# Altium schematic sheet [01] - POWER.SchDoc
size A3
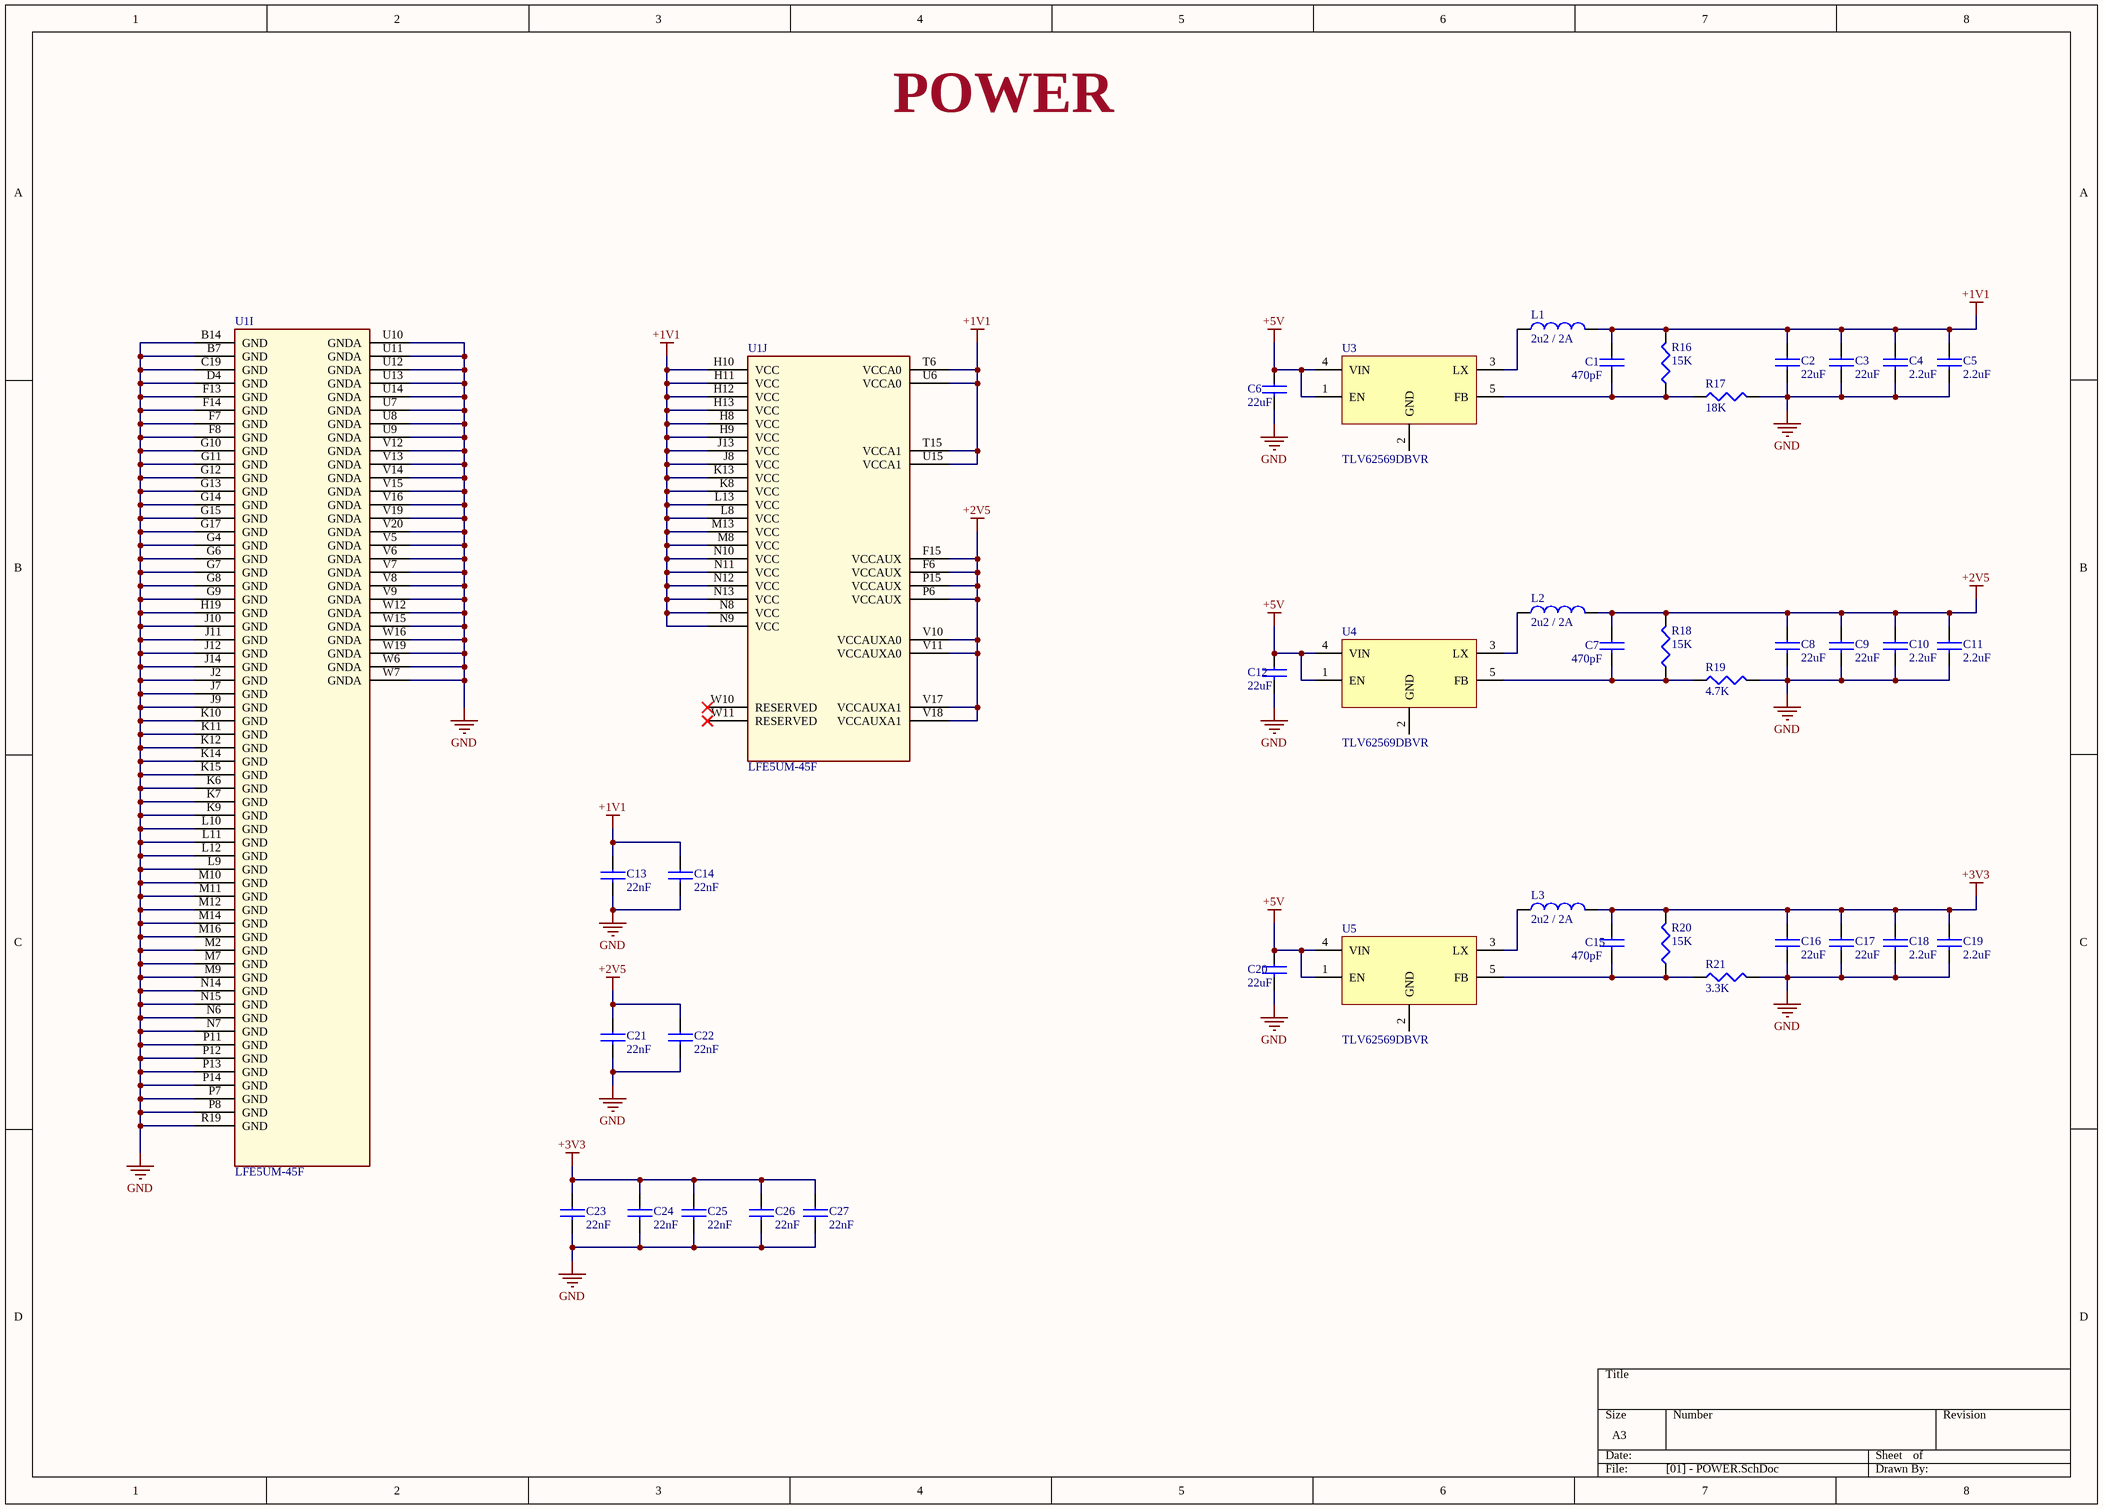
[diagram p0: [01] - POWER.SchDoc]

## Parts
C1  470pF  [C0603]
C2  22uF  [C0805]
C3  22uF  [C0805]
C4  2.2uF  [C0805]
C5  2.2uF  [C0805]
C6  22uF  [C0805]
C7  470pF  [C0603]
C8  22uF  [C0805]
C9  22uF  [C0805]
C10  2.2uF  [C0805]
C11  2.2uF  [C0805]
C12  22uF  [C0805]
C13  22nF  [C0603]
C14  22nF  [C0603]
C15  470pF  [C0603]
C16  22uF  [C0805]
C17  22uF  [C0805]
C18  2.2uF  [C0805]
C19  2.2uF  [C0805]
C20  22uF  [C0805]
C21  22nF  [C0603]
C22  22nF  [C0603]
C23  22nF  [C0603]
C24  22nF  [C0603]
C25  22nF  [C0603]
C26  22nF  [C0603]
C27  22nF  [C0603]
L1  2u2 / 2A  [C1210_IND]
L2  2u2 / 2A  [C1210_IND]
L3  2u2 / 2A  [C1210_IND]
R16  15K  [R0603]
R17  18K  [R0603]
R18  15K  [R0603]
R19  4.7K  [R0603]
R20  15K  [R0603]
R21  3.3K  [R0603]
U1  LFE5UM-45F  [LFE5BG381]  (parts I,J of 11)
U3  TLV62569DBVR  [SOT95P370X145-5N]
U4  TLV62569DBVR  [SOT95P370X145-5N]
U5  TLV62569DBVR  [SOT95P370X145-5N]

## Nets
+1V1: C1.1 C2.1 C3.1 C4.1 C5.1 C13.1 C14.1 L1.2 R16.2 U1.H8(VCC) U1.H9(VCC) U1.H10(VCC) U1.H11(VCC) U1.H12(VCC) U1.H13(VCC) U1.J8(VCC) U1.J13(VCC) U1.K8(VCC) U1.K13(VCC) U1.L8(VCC) U1.L13(VCC) U1.M8(VCC) U1.M13(VCC) U1.N8(VCC) U1.N9(VCC) U1.N10(VCC) U1.N11(VCC) U1.N12(VCC) U1.N13(VCC) U1.T6(VCCA0) U1.T15(VCCA1) U1.U6(VCCA0) U1.U15(VCCA1)
+2V5: C7.1 C8.1 C9.1 C10.1 C11.1 C21.1 C22.1 L2.2 R18.2 U1.F6(VCCAUX) U1.F15(VCCAUX) U1.P6(VCCAUX) U1.P15(VCCAUX) U1.V10(VCCAUXA0) U1.V11(VCCAUXA0) U1.V17(VCCAUXA1) U1.V18(VCCAUXA1)
+3V3: C15.1 C16.1 C17.1 C18.1 C19.1 C23.1 C24.1 C25.1 C26.1 C27.1 L3.2 R20.2
+5V: C6.1 C12.1 C20.1 U3.1(EN) U3.4(VIN) U4.1(EN) U4.4(VIN) U5.1(EN) U5.4(VIN)
GND: C2.2 C3.2 C4.2 C5.2 C6.2 C8.2 C9.2 C10.2 C11.2 C12.2 C13.2 C14.2 C16.2 C17.2 C18.2 C19.2 C20.2 C21.2 C22.2 C23.2 C24.2 C25.2 C26.2 C27.2 R17.2 R19.2 R21.2 U1.B7(GND) U1.B14(GND) U1.C19(GND) U1.D4(GND) U1.F7(GND) U1.F8(GND) U1.F13(GND) U1.F14(GND) U1.G4(GND) U1.G6(GND) U1.G7(GND) U1.G8(GND) U1.G9(GND) U1.G10(GND) U1.G11(GND) U1.G12(GND) U1.G13(GND) U1.G14(GND) U1.G15(GND) U1.G17(GND) U1.H19(GND) U1.J2(GND) U1.J7(GND) U1.J9(GND) U1.J10(GND) U1.J11(GND) U1.J12(GND) U1.J14(GND) U1.K6(GND) U1.K7(GND) U1.K9(GND) U1.K10(GND) U1.K11(GND) U1.K12(GND) U1.K14(GND) U1.K15(GND) U1.L9(GND) U1.L10(GND) U1.L11(GND) U1.L12(GND) U1.M2(GND) U1.M7(GND) U1.M9(GND) U1.M10(GND) U1.M11(GND) U1.M12(GND) U1.M14(GND) U1.M16(GND) U1.N6(GND) U1.N7(GND) U1.N14(GND) U1.N15(GND) U1.P7(GND) U1.P8(GND) U1.P11(GND) U1.P12(GND) U1.P13(GND) U1.P14(GND) U1.R19(GND) U1.U7(GNDA) U1.U8(GNDA) U1.U9(GNDA) U1.U10(GNDA) U1.U11(GNDA) U1.U12(GNDA) U1.U13(GNDA) U1.U14(GNDA) U1.V5(GNDA) U1.V6(GNDA) U1.V7(GNDA) U1.V8(GNDA) U1.V9(GNDA) U1.V12(GNDA) U1.V13(GNDA) U1.V14(GNDA) U1.V15(GNDA) U1.V16(GNDA) U1.V19(GNDA) U1.V20(GNDA) U1.W6(GNDA) U1.W7(GNDA) U1.W12(GNDA) U1.W15(GNDA) U1.W16(GNDA) U1.W19(GNDA)
NetC1_2: C1.2 R16.1 R17.1 U3.5(FB)
NetC7_2: C7.2 R18.1 R19.1 U4.5(FB)
NetC15_2: C15.2 R20.1 R21.1 U5.5(FB)
NetL1_1: L1.1 U3.3(LX)
NetL2_1: L2.1 U4.3(LX)
NetL3_1: L3.1 U5.3(LX)

Not connected (* = marked no-connect by the designer): U1 W10(RESERVED)* W11(RESERVED)*; U3 2(GND); U4 2(GND); U5 2(GND)

## Notes on the sheet
- POWER

## Library data of the parts
C1 C7 C15 = C0603C471K3RACTU: KEMET - C0603C471K3RACTU - SMD Multilayer Ceramic Capacitor, 470 pF, 25 V, 0603 [1608 Metric], ± 10%, X7R, C Series KEMET; Voltage Rating: 25V; Supplier 1: Digi-Key; Manufacturer: KEMET; Manufacturer Part Number: C0603C471K3RACTU; Stock 1: 28906; Pricing 1: 1=0.1, 10=0.067, 100=0.0298, 500=0.02126, 1000=0.0167 (USD); Mount: Surface Mount; Case/Package: 0603; Case Code (Metric): 1608; Case Code (Imperial): 0603; Dielectric Material: Ceramic; Min Operating Temperature: -55°C; Max Operating Temperature: 125°C; Package Quantity: 4000; Capacitance: 470pF; Tolerance: 10%; Packaging: Tape and Reel; Voltage Rating (DC): 25V; Dielectric: X7R; Termination: SMD/SMT; Length: 1.6mm; Height: 0.8mm; Width: 0.031inch; Thickness: 0.034inch; Lead Pitch: 0.7mm; Depth: 0.8mm; Radiation Hardening: No; REACH SVHC: No SVHC; ComponentLink1URL: http://www.farnell.com/datasheets/2064971.pdf?src-supplier=Element14; ComponentLink1Description: http://www.farnell.com/datasheets/2064971.pdf?src-supplier=Element14; ComponentLink2URL: http://www.farnell.com/datasheets/2746078.pdf?src-supplier=Farnell; ComponentLink2Description: http://www.farnell.com/datasheets/2746078.pdf?src-supplier=Farnell; ComponentLink3URL: https://api.kemet.com/component-edge/download/datasheet/C0603C471K3RACTU.pdf?src-supplier=Digi-Key; ComponentLink3Description: https://api.kemet.com/component-edge/download/datasheet/C0603C471K3RACTU.pdf?src-supplier=Digi-Key; ComponentLink4URL: http://components.arrow.com/part/dataview/2089229S9467247N7429?src-supplier=Arrow; ComponentLink4Description: http://components.arrow.com/part/dataview/2089229S9467247N7429?src-supplier=Arrow; ComponentLink5URL: http://www.mouser.com/ds/2/212/KEM_C1002_X7R_SMD-1102033.pdf?src-supplier=Mouser; ComponentLink5Description: http://www.mouser.com/ds/2/212/KEM_C1002_X7R_SMD-1102033.pdf?src-supplier=Mouser; ComponentLink6URL: http://www.farnell.com/datasheets/2746078.pdf?src-supplier=Newark; ComponentLink6Description: http://www.farnell.com/datasheets/2746078.pdf?src-supplier=Newark; ComponentLink7URL: http://components.arrow.com/part/dataview/0323_00323242?src-supplier=Arrow+Europe; ComponentLink7Description: http://components.arrow.com/part/dataview/0323_00323242?src-supplier=Arrow+Europe; Supplier Part Number 1: 399-9086-6-ND
C2 C3 C6 C8 C9 C12 C16 C17 C20 = CL21A226MQCLRNC: CAP CER 22UF 6.3V X5R 0805; Manufacturer: Samsung; Tolerance: 20%; Supplier 1: Digi-Key; Manufacturer Part Number: CL21A226MQCLRNC; Stock 1: 271195; Pricing 1: 1=0.36, 10=0.247, 100=0.1484, 500=0.11132, 1000=0.09401 (USD); Mount: Surface Mount; Case/Package: 0805; Case Code (Metric): 2012; Case Code (Imperial): 0805; Min Operating Temperature: -55°C; Max Operating Temperature: 85°C; Capacitance: 22uF; Dielectric: X5R; Package Quantity: 1; Packaging: Tape and Reel; Voltage Rating: 6.3V; Length: 2mm; Height: 0.85mm; Depth: 1.25mm; Width: 0.049inch; Thickness: 0.037inch; Radiation Hardening: No; Lead Free: Lead Free; ComponentLink1URL: http://www.samsungsem.com/kr/support/product-search/mlcc/CL21A226MQCLRNC.jsp?src-supplier=Digi-Key; ComponentLink1Description: http://www.samsungsem.com/kr/support/product-search/mlcc/CL21A226MQCLRNC.jsp?src-supplier=Digi-Key; Supplier Part Number 1: 1276-2413-6-ND
C4 C5 C10 C11 C18 C19 = CL21A225KAFNNNG: Ceramic capacitor SMD 0805 2.2 µF 25 V 10 %; Manufacturer: Samsung; Voltage Rating: 25V; Tolerance: 10%; Supplier 1: Digi-Key; Manufacturer Part Number: CL21A225KAFNNNG; Stock 1: 303381; Pricing 1: 1=0.15, 10=0.11, 100=0.0517, 500=0.03626, 1000=0.03002 (USD); Mount: Surface Mount; Case/Package: 0805; Case Code (Metric): 2012; Case Code (Imperial): 0805; Material: Ceramic; Min Operating Temperature: -55°C; Max Operating Temperature: 85°C; Package Quantity: 3000; Packaging: Tape and Reel; Capacitance: 2.2uF; Length: 0.079inch; Width: 0.049inch; Thickness: 0.053inch; ComponentLink1URL: http://www.samsungsem.com/global/support/library/product-catalog/__icsFiles/afieldfile/2014/11/13/MLCC.pdf?src-supplier=Digi-Key; ComponentLink1Description: http://www.samsungsem.com/global/support/library/product-catalog/__icsFiles/afieldfile/2014/11/13/MLCC.pdf?src-supplier=Digi-Key; ComponentLink2URL: https://produktinfo.conrad.com/datenblaetter/450000-474999/455579-da-01-en-VS_KONDENSATOR_0805.pdf?src-supplier=Conrad; ComponentLink2Description: https://produktinfo.conrad.com/datenblaetter/450000-474999/455579-da-01-en-VS_KONDENSATOR_0805.pdf?src-supplier=Conrad; Supplier Part Number 1: 1276-6458-6-ND
C13 C14 C21-C27 = CX0603MRX7R8BB223: Feed Through Capacitors 22nF X7R 20% 25V; Manufacturer: Yageo; Supplier 1: Digi-Key; Manufacturer Part Number: CX0603MRX7R8BB223; Stock 1: 11069; Pricing 1: 1=0.92, 10=0.676, 100=0.4636, 500=0.36702, 1000=0.30907 (USD); Mount: Surface Mount; Case/Package: 0603; Number of Pins: 2; Case Code (Metric): 1608; Case Code (Imperial): 0603; Min Operating Temperature: -55°C; Max Operating Temperature: 125°C; Capacitance: 22nF; Tolerance: 20%; Voltage Rating: 25V; Package Quantity: 1; Packaging: Tape and Reel; Voltage Rating (DC): 25V; Dielectric: X7R; Termination: SMD/SMT; Length: 0.063inch; Height: 0.65mm; Width: 0.034inch; Thickness: 0.03inch; REACH SVHC: No SVHC; Lead Free: Lead Free; ComponentLink1URL: http://www.yageo.com/NewPortal/_en/search/productDocs.jsp?YageoPartNumber=CX0603MRX7R8BB223&src-supplier=Digi-Key; ComponentLink1Description: http://www.yageo.com/NewPortal/_en/search/productDocs.jsp?YageoPartNumber=CX0603MRX7R8BB223&src-supplier=Digi-Key; Supplier Part Number 1: 311-1234-6-ND
L1-L3 = L1210R2R2MDWIT: FIXED IND 2.2UH 2A 80 MOHM SMD; Manufacturer: KEMET; Core Material: Ferrite; Tolerance: 20%; Shielding: Unshielded; Self Resonant Frequency: 190MHz; DC Resistance (DCR): 80mR; Test Frequency: 100kHz; DC Current: 1.13A; Supplier 1: Digi-Key; Manufacturer Part Number: L1210R2R2MDWIT; Stock 1: 2998; Pricing 1: 1=0.55, 10=0.479, 100=0.3421, 500=0.28738 (USD); Mount: Surface Mount; Case/Package: 1210; Case Code (Metric): 3225; Case Code (Imperial): 1210; Min Operating Temperature: -40°C; Max Operating Temperature: 105°C; Inductance: 2.2uH; Max DC Current: 2A; Package Quantity: 1000; Current Rating: 2A; Packaging: Tape and Reel; Inductance Tolerance: 20%; Composition: Wirewound,Ceramic; Termination: SMD/SMT; Military Standard: Not; Length: 0.126inch; Height: 2.5mm; Width: 0.098inch; Height - Seated (Max): 0.106inch; Depth: 2.7mm; Radiation Hardening: No; REACH SVHC: No SVHC; ComponentLink1URL: https://content.kemet.com/datasheets/F3115.pdf?src-supplier=Mouser; ComponentLink1Description: https://content.kemet.com/datasheets/F3115.pdf?src-supplier=Mouser; ComponentLink2URL: https://content.kemet.com/datasheets/F3115.pdf?src-supplier=Avnet+Europe; ComponentLink2Description: https://content.kemet.com/datasheets/F3115.pdf?src-supplier=Avnet+Europe; ComponentLink3URL: http://www.farnell.com/datasheets/27262.pdf?src-supplier=Element14; ComponentLink3Description: http://www.farnell.com/datasheets/27262.pdf?src-supplier=Element14; ComponentLink4URL: https://api.kemet.com/component-edge/download/datasheet/L1210R2R2MDWIT.pdf?src-supplier=Digi-Key; ComponentLink4Description: https://api.kemet.com/component-edge/download/datasheet/L1210R2R2MDWIT.pdf?src-supplier=Digi-Key; ComponentLink5URL: http://www.kemet.com/Lists/ProductCatalog/Attachments/57/F3115.pdf?src-supplier=Avnet; ComponentLink5Description: http://www.kemet.com/Lists/ProductCatalog/Attachments/57/F3115.pdf?src-supplier=Avnet; Supplier Part Number 1: 399-9598-6-ND
R16 R18 R20 = RC0603FR-0715KL: Res Thick Film 0603 15K Ohm 1% 1/10W ?100ppm/?C Molded SMD Paper T/R; Manufacturer: Yageo; Temperature Coefficient: 100ppm/°C; Resistance: 15kR; Power Rating: 100mW; Voltage Rating (DC): 50V; Supplier 1: Digi-Key; Manufacturer Part Number: RC0603FR-0715KL; Stock 1: 3342455; Pricing 1: 1=0.1, 10=0.023, 100=0.0094, 1000=0.00421, 2500=0.00366 (USD); Case/Package: 0603; Number of Pins: 2; Case Code (Metric): 1608; Case Code (Imperial): 0603; Min Operating Temperature: -55°C; Max Operating Temperature: 155°C; Tolerance: 1%; Composition: Thick Film; Packaging: Tape and Reel; Package Quantity: 1; Voltage Rating: 50V; Number of Terminations: 2; Termination: SMD/SMT; Military Standard: Not; Max Power Dissipation: 100mW; Features: Moisture Resistant; Length: 1.6mm; Height: 0.022inch; Width: 0.031inch; Depth: 0.8mm; Lead Free: Lead Free; REACH SVHC: Unknown; ComponentLink1URL: http://www.yageo.com/documents/recent/PYu-RC_Group_51_RoHS_L_10.pdf?src-supplier=Digi-Key; ComponentLink1Description: http://www.yageo.com/documents/recent/PYu-RC_Group_51_RoHS_L_10.pdf?src-supplier=Digi-Key; ComponentLink2URL: http://www.yageo.com/documents/recent/PYu-RC_Group_51_RoHS_L_9.pdf?src-supplier=Digi-Key; ComponentLink2Description: http://www.yageo.com/documents/recent/PYu-RC_Group_51_RoHS_L_9.pdf?src-supplier=Digi-Key; ComponentLink3URL: https://www.verical.com/server-webapp/html/getDatasheet?partID=327895&src-supplier=Verical; ComponentLink3Description: https://www.verical.com/server-webapp/html/getDatasheet?partID=327895&src-supplier=Verical; Supplier Part Number 1: 311-15.0KHRCT-ND
R17 = RC0603FR-0718KL: YAGEO (PHYCOMP) - RC0603FR-0718KL - SMD Chip Resistor, 0603 [1608 Metric], 18 kohm, RC Series, 75 V, Thick Film, 100 mW; Resistance: 18kR; Power Rating: 100mW; Tolerance: 1%; Voltage Rating: 75V; Voltage Rating (DC): 50V; Temperature Coefficient: 100ppm/°C; Supplier 1: Digi-Key; Manufacturer: Yageo; Manufacturer Part Number: RC0603FR-0718KL; Stock 1: 0; Pricing 1: 1=0.1, 10=0.023, 100=0.0094, 1000=0.00421, 2500=0.00366 (USD); Case/Package: 0603; Number of Pins: 2; Weight: 7.1E-05oz; Case Code (Imperial): 0603; Case Code (Metric): 1608; Min Operating Temperature: -55°C; Max Operating Temperature: 155°C; Composition: Thick Film; Packaging: Tape and Reel; Termination: SMD/SMT; Military Standard: Not; Length: 1.6mm; Height: 0.45mm; Width: 0.8mm; Depth: 0.8mm; REACH SVHC: Unknown; Lead Free: Lead Free; ComponentLink1URL: http://documents.rs-components.com/techlib://itc_doclist_GB.htm?stockno=5049959&src-supplier=RSComponents; ComponentLink1Description: http://documents.rs-components.com/techlib://itc_doclist_GB.htm?stockno=5049959&src-supplier=RSComponents; ComponentLink2URL: https://www.verical.com/server-webapp/html/getDatasheet?partID=325162&src-supplier=Verical; ComponentLink2Description: https://www.verical.com/server-webapp/html/getDatasheet?partID=325162&src-supplier=Verical; ComponentLink3URL: http://www.farnell.com/datasheets/2167052.pdf?src-supplier=Element14; ComponentLink3Description: http://www.farnell.com/datasheets/2167052.pdf?src-supplier=Element14; ComponentLink4URL: http://www.farnell.com/datasheets/1868787.pdf?src-supplier=Element14; ComponentLink4Description: http://www.farnell.com/datasheets/1868787.pdf?src-supplier=Element14; Supplier Part Number 1: 311-18.0KHRDKR-ND
R19 = RC0603FR-074K7L: RES SMD 4.7K OHM 1% 1/10W 0603; Manufacturer: Yageo; Resistance: 4.7kR; Temperature Coefficient: 100ppm/°C; Power Rating: 100mW; Voltage Rating (DC): 50V; Supplier 1: Digi-Key; Manufacturer Part Number: RC0603FR-074K7L; Stock 1: 1446473; Pricing 1: 1=0.1, 10=0.023, 100=0.0094, 1000=0.00421, 2500=0.00366 (USD); Case/Package: 0603; Number of Pins: 2; Case Code (Imperial): 0603; Case Code (Metric): 1608; Min Operating Temperature: -55°C; Max Operating Temperature: 155°C; Tolerance: 1%; Composition: Thick Film; Packaging: Tape and Reel; Voltage Rating: 50V; Termination: SMD/SMT; Military Standard: Not; Length: 1.6mm; Height: 0.45mm; Width: 0.8mm; Depth: 0.8mm; Lead Pitch: 0.3mm; REACH SVHC: No SVHC; Lead Free: Lead Free; ComponentLink1URL: https://www.verical.com/server-webapp/html/getDatasheet?partID=422754&src-supplier=Verical; ComponentLink1Description: https://www.verical.com/server-webapp/html/getDatasheet?partID=422754&src-supplier=Verical; ComponentLink2URL: http://www.farnell.com/datasheets/2167052.pdf?src-supplier=Element14; ComponentLink2Description: http://www.farnell.com/datasheets/2167052.pdf?src-supplier=Element14; ComponentLink3URL: http://www.farnell.com/datasheets/38590.pdf?src-supplier=Element14; ComponentLink3Description: http://www.farnell.com/datasheets/38590.pdf?src-supplier=Element14; ComponentLink4URL: http://www.farnell.com/datasheets/1868787.pdf?src-supplier=Element14; ComponentLink4Description: http://www.farnell.com/datasheets/1868787.pdf?src-supplier=Element14; Supplier Part Number 1: 311-4.70KHRCT-ND
R21 = RC0603FR-073K3L: YAGEO - RC0603FR-073K3L - SMD Chip Resistor, 0603 [1608 Metric], 3.3 kohm, RC Series, 75 V, Thick Film, 100 mW; Resistance: 3.3kR; Tolerance: 1%; Temperature Coefficient: 100ppm/°C; Voltage Rating (DC): 50V; Power Rating: 100mW; Supplier 1: Digi-Key; Manufacturer: Yageo; Manufacturer Part Number: RC0603FR-073K3L; Stock 1: 1337597; Pricing 1: 1=0.1, 10=0.023, 100=0.0094, 1000=0.00421, 2500=0.00366 (USD); Case/Package: 0603; Number of Pins: 2; Case Code (Imperial): 0603; Case Code (Metric): 1608; Min Operating Temperature: -55°C; Max Operating Temperature: 155°C; Packaging: Tape and Reel; Composition: Thick Film; Voltage Rating: 50V; Package Quantity: 1; Termination: SMD/SMT; Number of Terminations: 2; Military Standard: Not; Max Power Dissipation: 100mW; Features: Moisture Resistant; Length: 1.6mm; Height: 0.45mm; Width: 0.8mm; Depth: 0.8mm; REACH SVHC: No SVHC; Lead Free: Lead Free; ComponentLink1URL: http://www.yageo.com/documents/recent/PYu-RC_Group_51_RoHS_L_10.pdf?src-supplier=Digi-Key; ComponentLink1Description: http://www.yageo.com/documents/recent/PYu-RC_Group_51_RoHS_L_10.pdf?src-supplier=Digi-Key; ComponentLink2URL: http://www.farnell.com/datasheets/2167052.pdf?src-supplier=Element14; ComponentLink2Description: http://www.farnell.com/datasheets/2167052.pdf?src-supplier=Element14; ComponentLink3URL: http://www.farnell.com/datasheets/1686128.pdf?src-supplier=Element14; ComponentLink3Description: http://www.farnell.com/datasheets/1686128.pdf?src-supplier=Element14; ComponentLink4URL: http://www.farnell.com/datasheets/1868787.pdf?src-supplier=Element14; ComponentLink4Description: http://www.farnell.com/datasheets/1868787.pdf?src-supplier=Element14; Supplier Part Number 1: 311-3.30KHRDKR-ND
U1 = LFE5UM-45F-6BG381C: ECP5 Series 44 K LUTs 203 I/O 1.1 V Slow Surface Mount FPGA - CABGA-381; Manufacturer: Lattice Semiconductor; Number of Logic Blocks (LABs): 11000; Number of Logic Elements/Cells: 44000; RAM Size: 1990656b; Number of I/Os: 203; Supplier 1: Digi-Key; Manufacturer Part Number: LFE5UM-45F-6BG381C; Stock 1: 0; Pricing 1: 90=19.13967 (USD); Mount: Surface Mount; Case/Package: FBGA; Min Operating Temperature: 0°C; Max Operating Temperature: 85°C; Lead Free: Lead Free; ComponentLink1URL: http://www.latticesemi.com/~/media/LatticeSemi/Documents/DataSheets/ECP5/DS1044.pdf?src-supplier=Digi-Key; ComponentLink1Description: http://www.latticesemi.com/~/media/LatticeSemi/Documents/DataSheets/ECP5/DS1044.pdf?src-supplier=Digi-Key; Supplier Part Number 1: 220-1994-ND
U3-U5 = TLV62569DBVR: 1-A HIGH EFFICIENCY STEP-DOWN; Manufacturer: Texas Instruments; Output Type: Adjustable; Output Configuration: Positive; Min Input Voltage: 2.5V; Max Input Voltage: 5.5V; Min Output Voltage: 600mV; Output Current: 2A; Switching Frequency: 1.5MHz; Synchronous Rectifier: Yes; Supplier 1: Digi-Key; Manufacturer Part Number: TLV62569DBVR; Stock 1: 2680; Pricing 1: 1=0.53, 10=0.454, 25=0.4236, 100=0.3146, 250=0.2662, 500=0.2541, 1000=0.18755 (USD); Mount: Surface Mount; Case/Package: SOT-23-5; Min Operating Temperature: -40°C; Max Operating Temperature: 125°C; Packaging: Cut Tape; Max Output Voltage: 5.5V; ComponentLink1URL: http://www.ti.com/lit/ds/symlink/tlv62569.pdf?src-supplier=Farnell; ComponentLink1Description: http://www.ti.com/lit/ds/symlink/tlv62569.pdf?src-supplier=Farnell; ComponentLink2URL: http://www.ti.com/lit/ds/symlink/tlv62569.pdf?src-supplier=Digi-Key; ComponentLink2Description: http://www.ti.com/lit/ds/symlink/tlv62569.pdf?src-supplier=Digi-Key; Supplier Part Number 1: 296-47360-6-ND